# Altium project AES_12ax7 Test Board.PrjPcb
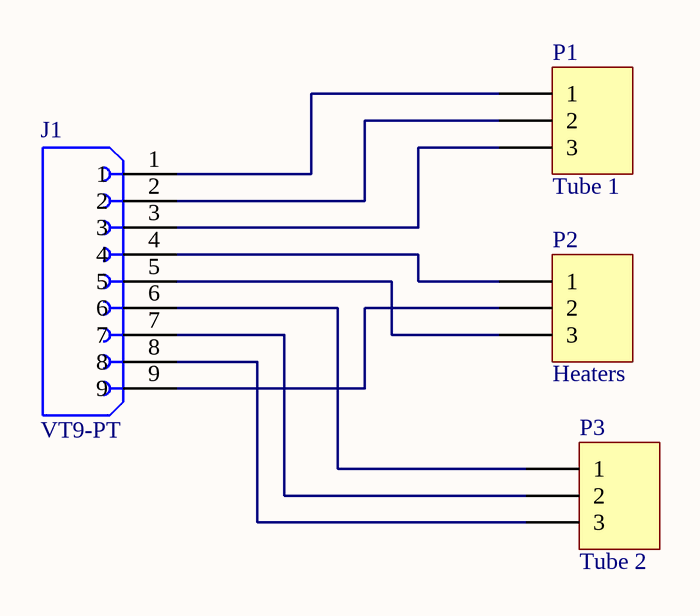
[diagram p0: Schem.SchDoc]
1 sheet, 4 parts. Net scope: global (net labels, ports and power ports of the same name join across sheets).
Board file: 12ax7 Test Board.PcbDoc

## Sheet Schem.SchDoc
size A; SheetNumber: 1; SheetTotal: 1

### Parts
J1  VT9-PT  [BELTON_VT9-PT]
P1  Tube 1  [HDR1X3]
P2  Heaters  [HDR1X3]
P3  Tube 2  [HDR1X3]

### Nets
NetJ1_1: J1.1 P1.1
NetJ1_2: J1.2 P1.2
NetJ1_3: J1.3 P1.3
NetJ1_4: J1.4 P2.1
NetJ1_5: J1.5 P2.3
NetJ1_6: J1.6 P3.1
NetJ1_7: J1.7 P3.2
NetJ1_8: J1.8 P3.3
NetJ1_9: J1.9 P2.2

### Library data of the parts
J1 = VT9-PT: 9 PIN MIN AUTOWAVE SOLDER SOCKET; MF: Belton Engineering Co., Ltd.; Package: Package; Purchase-URL: https://pricing.snapeda.com/search/part/VT9-PT/?ref=eda; Check_prices: https://www.snapeda.com/parts/VT9-PT/Belton%20Engineering%20Co.,%20Ltd./view-part/3208909/?ref=eda; Value: *; Price: None; MP: VT9-PT; Availability: In Stock; SnapEDA_Link: https://www.snapeda.com/parts/VT9-PT/Belton%20Engineering%20Co.,%20Ltd./view-part/3208909/?ref=snap
P1-P3 = Header 3: Header, 3-Pin; LatestRevisionDate: 17-Jul-2002; LatestRevisionNote: Re-released for DXP Platform.; Publisher: Altium Limited